# EAGLE design ArduinoProgrammer (EAGLE 7.6.0)
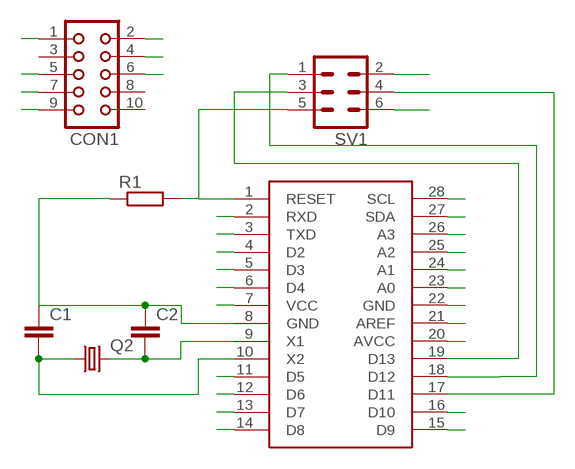
[diagram p0: schematic, sheet 1]

## Parts
C1  C-EU025-024X044  [C025-024X044]
C2  C-EU025-024X044  [C025-024X044]
CON1  CON10  [CON10]
Q2  CRYSTALHC49S  [HC49/S]
R1  R-EU_0207/10  [0207/10]
SV1  MA03-2  [MA03-2]
U$1  ATMEGA328P-PU  [DIL28-3]

## Nets
A0[MODE]: U$1.23(A0)
A1: U$1.24(A1)
A2[MIN]: U$1.25(A2)
A3[AL]: U$1.26(A3)
A4[SDA]: U$1.27(SDA)
A5[SCL]: U$1.28(SCL)
AREF: U$1.21(AREF)
DIO1(TX): U$1.3(TXD)
DIO2[L0]: U$1.4(D2)
DIO3(PWM)[TONE]: U$1.5(D3)
DIO4[L1]: U$1.6(D4)
DIO5(PWM)[AM]: U$1.11(D5)
DIO6(PWM)[AH]: U$1.12(D6)
DIO7[L2]: U$1.13(D7)
DIO8[L3]: U$1.14(D8)
DIO9(PWM)[SEC]: U$1.15(D9)
DIO10(PWM)[MIN]: U$1.16(D10)
DIO11(PWM)MOSI[HR]: CON1.1 SV1.4 U$1.17(D11)
DIO12/MISO[L4]: CON1.9 SV1.1 U$1.18(D12)
DPIO0(RX): U$1.2(RXD)
GND: C1.1 C2.1 CON1.4 R1.1 SV1.6 U$1.8(GND) U$1.22(GND)
N$2: CON1.5
N$7: CON1.6
RESET: R1.2 SV1.5 U$1.1(RESET)
SCK[L5]: CON1.7 SV1.3 U$1.19(D13)
VCC: CON1.2 SV1.2 U$1.7(VCC) U$1.20(AVCC)
X1: C2.2 Q2.2 U$1.9(X1)
X2: C1.2 Q2.1 U$1.10(X2)
Unconnected: CON1.3 CON1.8 CON1.10

## Library data of the parts
C1 C2 = rcl:C-EU: CAPACITOR, European symbol
CON1 = con-harting:CON10: CONNECTOR; OC_FARNELL: unknown; OC_NEWARK: unknown
Q2 = crystal:CRYSTAL: CRYSTAL; OC_FARNELL: 1667008; OC_NEWARK: unknown
R1 = rcl:R-EU_: RESISTOR, European symbol
SV1 = con-lstb:MA03-2: PIN HEADER; OC_FARNELL: unknown; OC_NEWARK: unknown
U$1 = atmel2:ATMEGA328P-PU

## Board
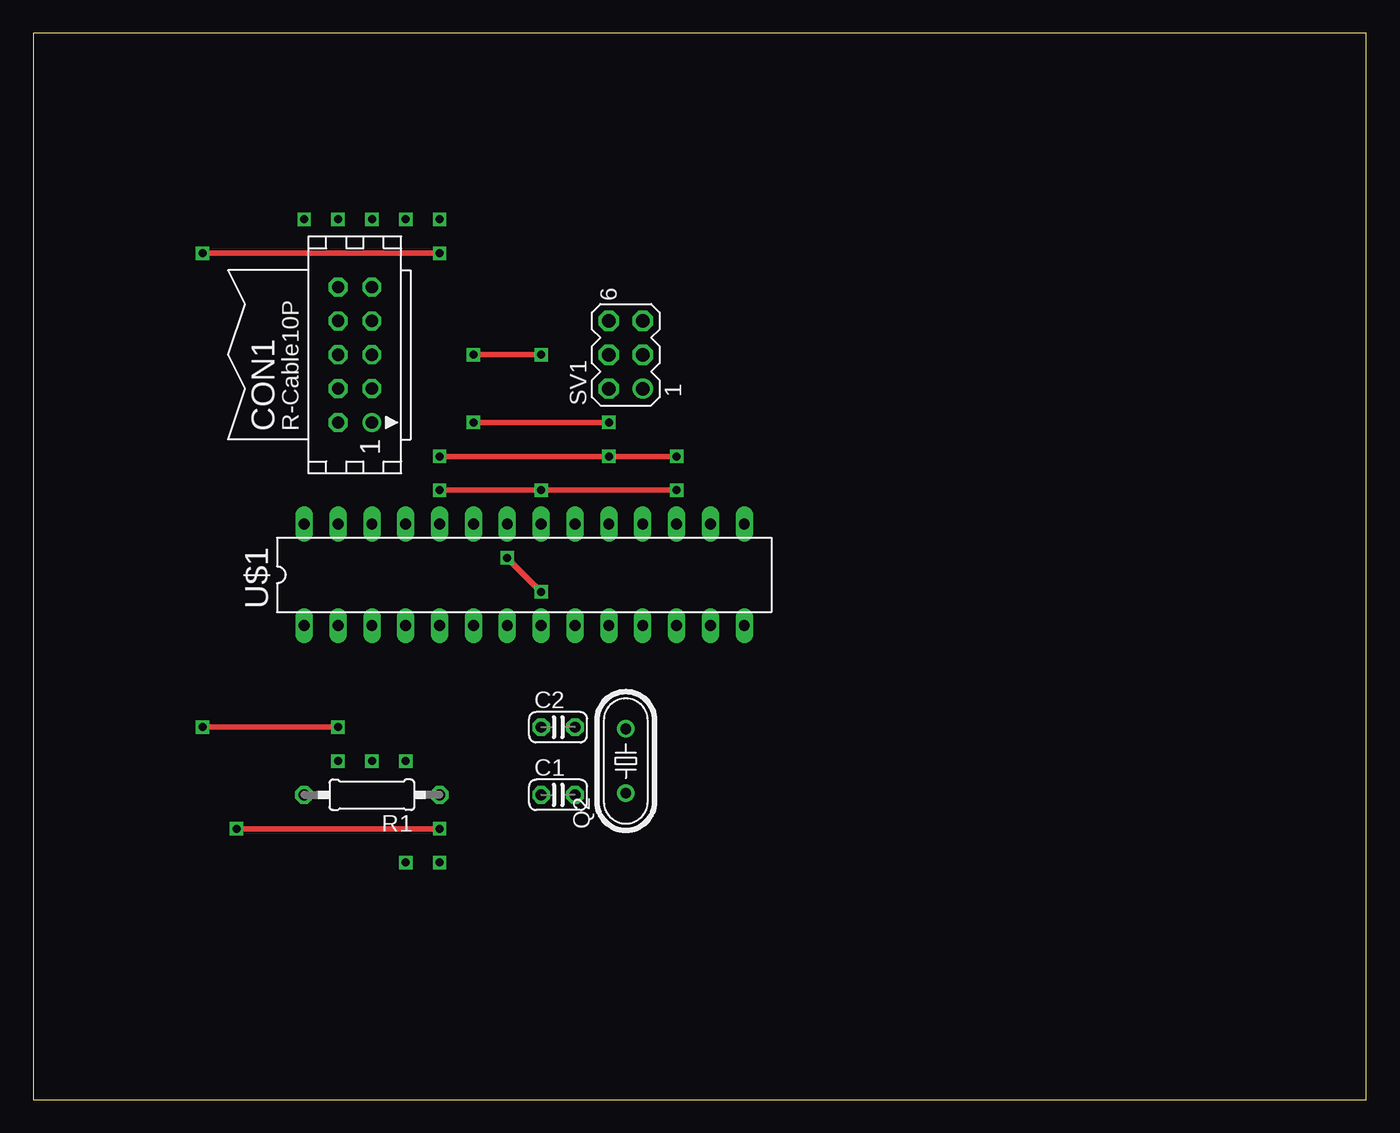
[diagram p1: board, top side]
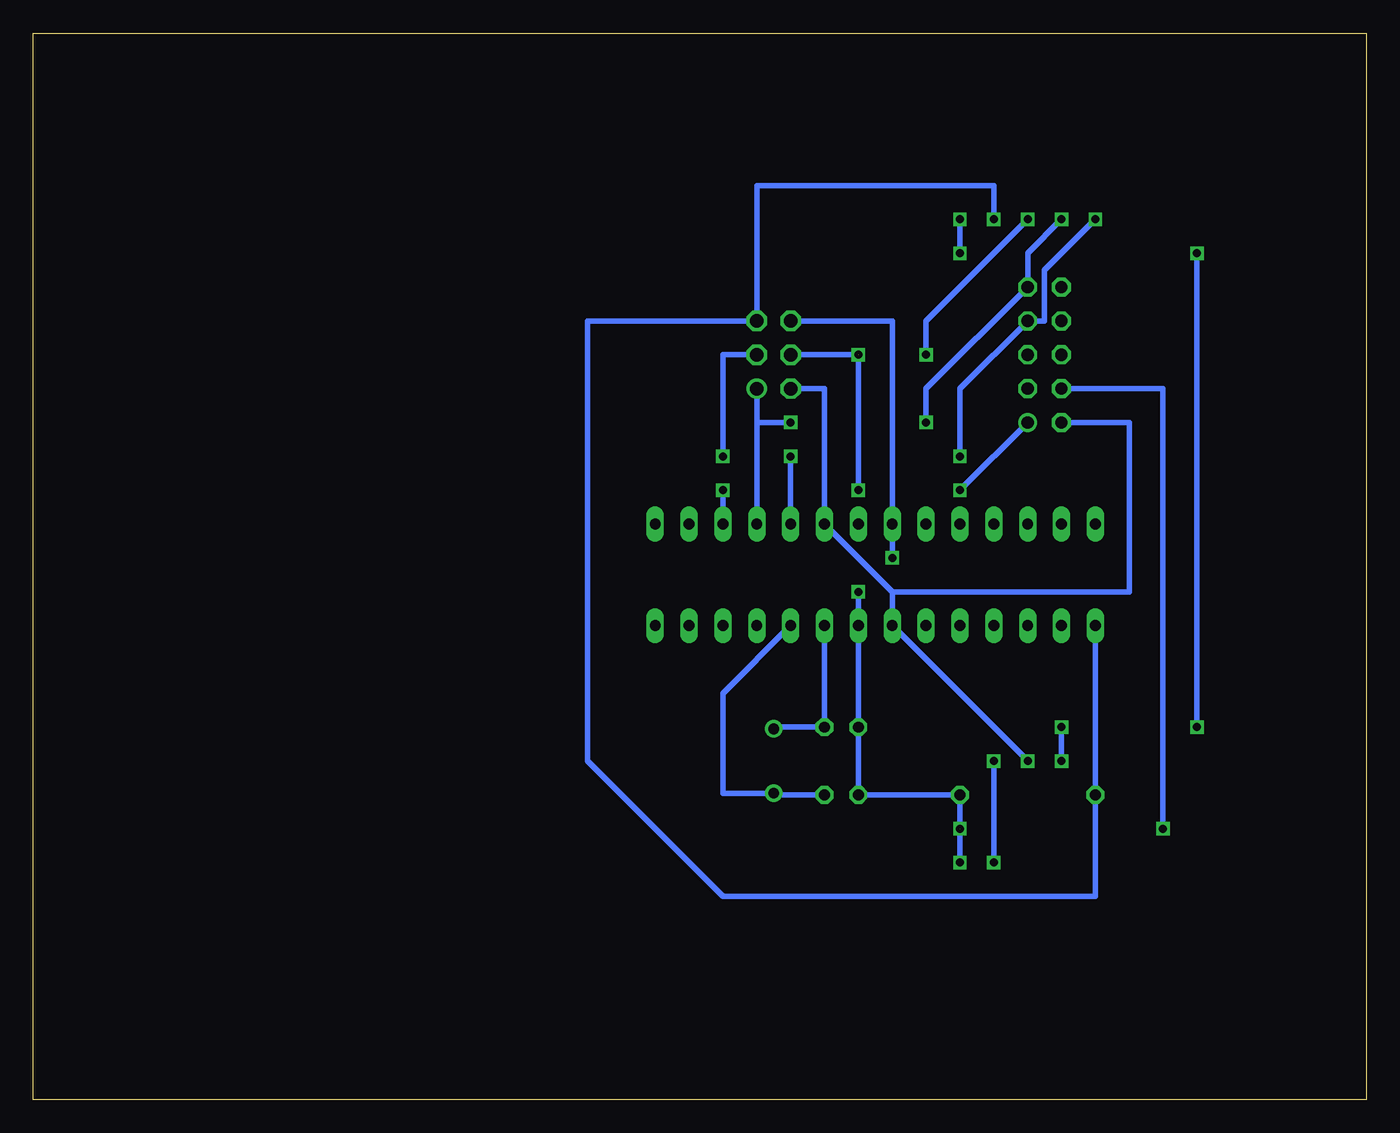
[diagram p2: board, bottom side, seen from below]

Size 100 x 80 mm. Coordinates in mm from the lower left corner, seen from the top.
Outline: 0,0 100,0 100,80 0,80 0,0
Copper layers (1*16): Top 0.035mm / dielectric 1.5mm / Bottom 0.035mm
Design rules "default": minimum track width 10mil, minimum drill 24mil, track to track 8mil, track to pad 8mil, pad to pad 8mil, via to via 8mil, smd to smd 8mil, copper to edge 40mil, drill to drill 8mil, minimum pad ring 10mil, minimum via ring 8mil, stop-mask expansion 4mil, vias tented up to drill 0mil, thermal gap 10mil

### Footprints (pad centres in the part's own frame; a part is rotated, then mirrored left to right if it is on the bottom)
C025-024X044 = drill 0.813 octagon: 1 -1.27,0; 2 1.27,0
CON10 = drill 0.914: 1 -5.08,-1.27 | drill 0.914 octagon: 2 -5.08,1.27; 3 -2.54,-1.27; 4 -2.54,1.27; 5 0,-1.27; 6 0,1.27; 7 2.54,-1.27; 8 2.54,1.27; 9 5.08,-1.27; 10 5.08,1.27
HC49/S = drill 0.813: 1 -2.413,0; 2 2.413,0
0207/10 = drill 0.813 octagon: 1 -5.08,0; 2 5.08,0
MA03-2 = drill 1.016: 1 -2.54,-1.27 | drill 1.016 octagon: 2 -2.54,1.27; 3 0,-1.27; 4 0,1.27; 5 2.54,-1.27; 6 2.54,1.27
DIL28-3 = drill 0.813 long: 1 -16.51,-3.81; 2 -13.97,-3.81; 3 -11.43,-3.81; 4 -8.89,-3.81; 5 -6.35,-3.81; 6 -3.81,-3.81; 7 -1.27,-3.81; 8 1.27,-3.81; 9 3.81,-3.81; 10 6.35,-3.81; 11 8.89,-3.81; 12 11.43,-3.81; 13 13.97,-3.81; 14 16.51,-3.81; 15 16.51,3.81; 16 13.97,3.81; 17 11.43,3.81; 18 8.89,3.81; 19 6.35,3.81; 20 3.81,3.81; 21 1.27,3.81; 22 -1.27,3.81; 23 -3.81,3.81; 24 -6.35,3.81; 25 -8.89,3.81; 26 -11.43,3.81; 27 -13.97,3.81; 28 -16.51,3.81

### Placement (x,y rotation side)
C1  39.37,22.86 0 top
C2  39.37,27.94 0 top
CON1  24.13,55.88 90 top
Q2  44.45,25.4 90 top
R1  25.4,22.86 180 top
SV1  44.45,55.88 90 top
U$1  36.83,39.37 0 top

### Tracks (layer width: path | path; a pad name or v marks a point on that pad's centre or on a via)
5VSWITCH  (via drill 0.6)
  Top 0.406: v30.48,63.5 v12.7,63.5 | v12.7,27.94 v22.86,27.94
  Bottom 0.406: v30.48,66.04 v30.48,63.5 | v12.7,63.5 v12.7,27.94 | v22.86,27.94 v22.86,25.4
+5V  (via drill 0.6)
  Bottom 0.406: v27.94,25.4 v27.94,17.78
DIO11(PWM)MOSI[HR]  (via drill 0.6)  (1 unrouted)
  Top 0.406: v48.26,45.72 v38.1,45.72 v30.48,45.72 | v33.02,55.88 v38.1,55.88
  Bottom 0.406: SV1.4 v38.1,55.88 v38.1,45.72 | v48.26,45.72 U$1.17 | CON1.1 v30.48,45.72 | v25.4,66.04 33.02,58.42 v33.02,55.88
DIO12/MISO[L4]  (via drill 0.6)
  Top 0.406: v33.02,50.8 v43.18,50.8
  Bottom 0.406: SV1.1 45.72,50.8 | 45.72,50.8 U$1.18 | v22.86,66.04 25.4,63.5 CON1.9 33.02,53.34 v33.02,50.8 | v43.18,50.8 45.72,50.8
GND  (via drill 0.6)  (1 unrouted)
  Top 0.406: v35.56,40.64 v38.1,38.1 | v15.24,20.32 v30.48,20.32
  Bottom 0.406: C1.1 U$1.8 v38.1,38.1 | C1.1 C2.1 | C1.1 R1.1 v30.48,20.32 v30.48,17.78 | v35.56,40.64 U$1.22 35.56,58.42 SV1.6 | CON1.4 15.24,53.34 v15.24,20.32
RESET  (via drill 0.6)
  Bottom 0.406: U$1.1 R1.2 20.32,15.24 48.26,15.24 58.42,25.4 58.42,58.42 SV1.5 45.72,68.58 27.94,68.58 v27.94,66.04
SCK[L5]  (via drill 0.6)
  Top 0.406: v48.26,48.26 v43.18,48.26 v30.48,48.26
  Bottom 0.406: SV1.3 48.26,55.88 v48.26,48.26 | v43.18,48.26 U$1.19 | v20.32,66.04 24.13,62.23 24.13,58.42 CON1.7 30.48,53.34 v30.48,48.26
VCC  (via drill 0.6)
  Bottom 0.406: v25.4,25.4 U$1.7 35.56,38.1 | 35.56,38.1 U$1.20 40.64,53.34 SV1.2 | CON1.2 17.78,50.8 17.78,38.1 35.56,38.1
X1
  Bottom 0.406: U$1.9 C2.2 44.45,27.94 Q2.2
X2
  Bottom 0.406: C1.2 44.45,22.86 Q2.1 48.26,22.99 48.26,30.48 U$1.10